# EAGLE schematic untitled (EAGLE 7.6.0)
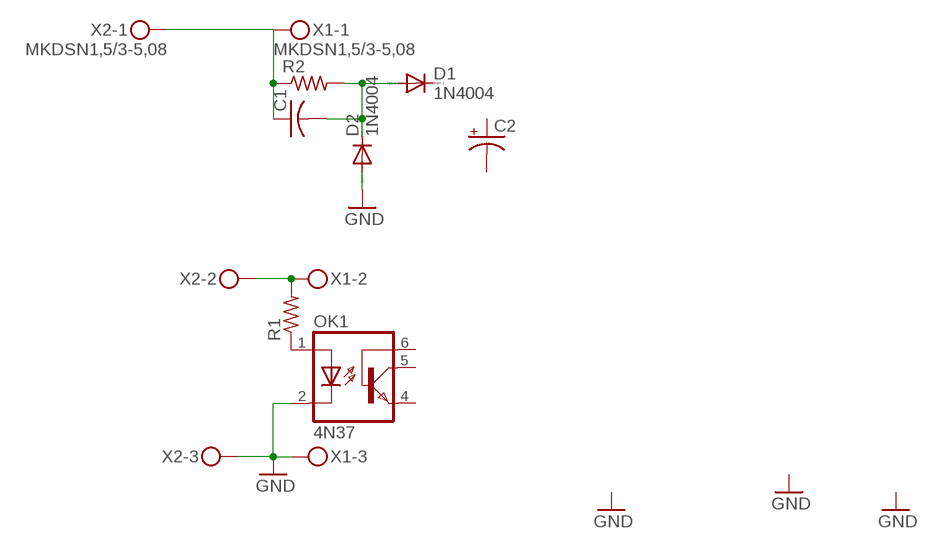
[diagram p0: schematic, sheet 1]

## Parts
C1  C-US275-205X316  [C275-205X316]
C2  CPOL-USE5-13  [E5-13]
D1  1N4004  [DO41-10]
D2  1N4004  [DO41-10]
OK1  4N37  [DIL06]
R1  R-US_0617/5V  [0617V]
R2  R-US_0617/5V  [0617V]
X1  MKDSN1,5/3-5,08  [MKDSN1,5/3-5,08]
X2  MKDSN1,5/3-5,08  [MKDSN1,5/3-5,08]

## Nets
GND: D2.A OK1.2(C) X1.3 X2.3
N$1: R1.2 X1.2 X2.2
N$2: OK1.1(A) R1.1
N$3: C1.1 R2.1 X1.1 X2.1
N$4: C1.2 D1.A D2.C R2.2
Unconnected: C2.+ C2.- D1.C OK1.4(EMI) OK1.5(COL) OK1.6(BAS)

## Library data of the parts
C1 = rcl:C-US: CAPACITOR, American symbol
C2 = rcl:CPOL-US: POLARIZED CAPACITOR, American symbol
D1 D2 = diode:1N4004: DIODE general purpose rectifier, 1 A
OK1 = optocoupler:4N37: OPTO COUPLER Source: http://www.fairchildsemi.com/pf/4N/4N35-M.html; MF: FAIRCHILD SEMICONDUCTOR; MPN: 4N37; OC_FARNELL: 1612456; OC_NEWARK: 72K9948
R1 R2 = rcl:R-US_: RESISTOR, American symbol
X1 X2 = con-phoenix-508:MKDSN1,5/3-5,08: MKDSN 1,5/ 3-5,08 Printklemme Nennstrom: 13,5 A Nennspannung: 250 V Rastermaß: 5,08 mm Polzahl: 3 Anschlussart: Schraubanschluss Montage: Löten Anschlussrichtung Leiter/Platine: 0 ° Artikelnummer: 1729131 Source: http://eshop.phoenixcontact.com .. 1729131.pdf